# EasyEDA Pro project DEVELOPMENT-BOARD-PIC16F887.eprj

# Schematic Schematic1
Board Name: Board1; Create Date: 2025-02-07; Page Name: P1; Project Name: Placa micros; Schematic Name: Schematic1; Update Date: 2025-03-17; Company: EasyEDA.com; Page Size: A4; Version: V1.0
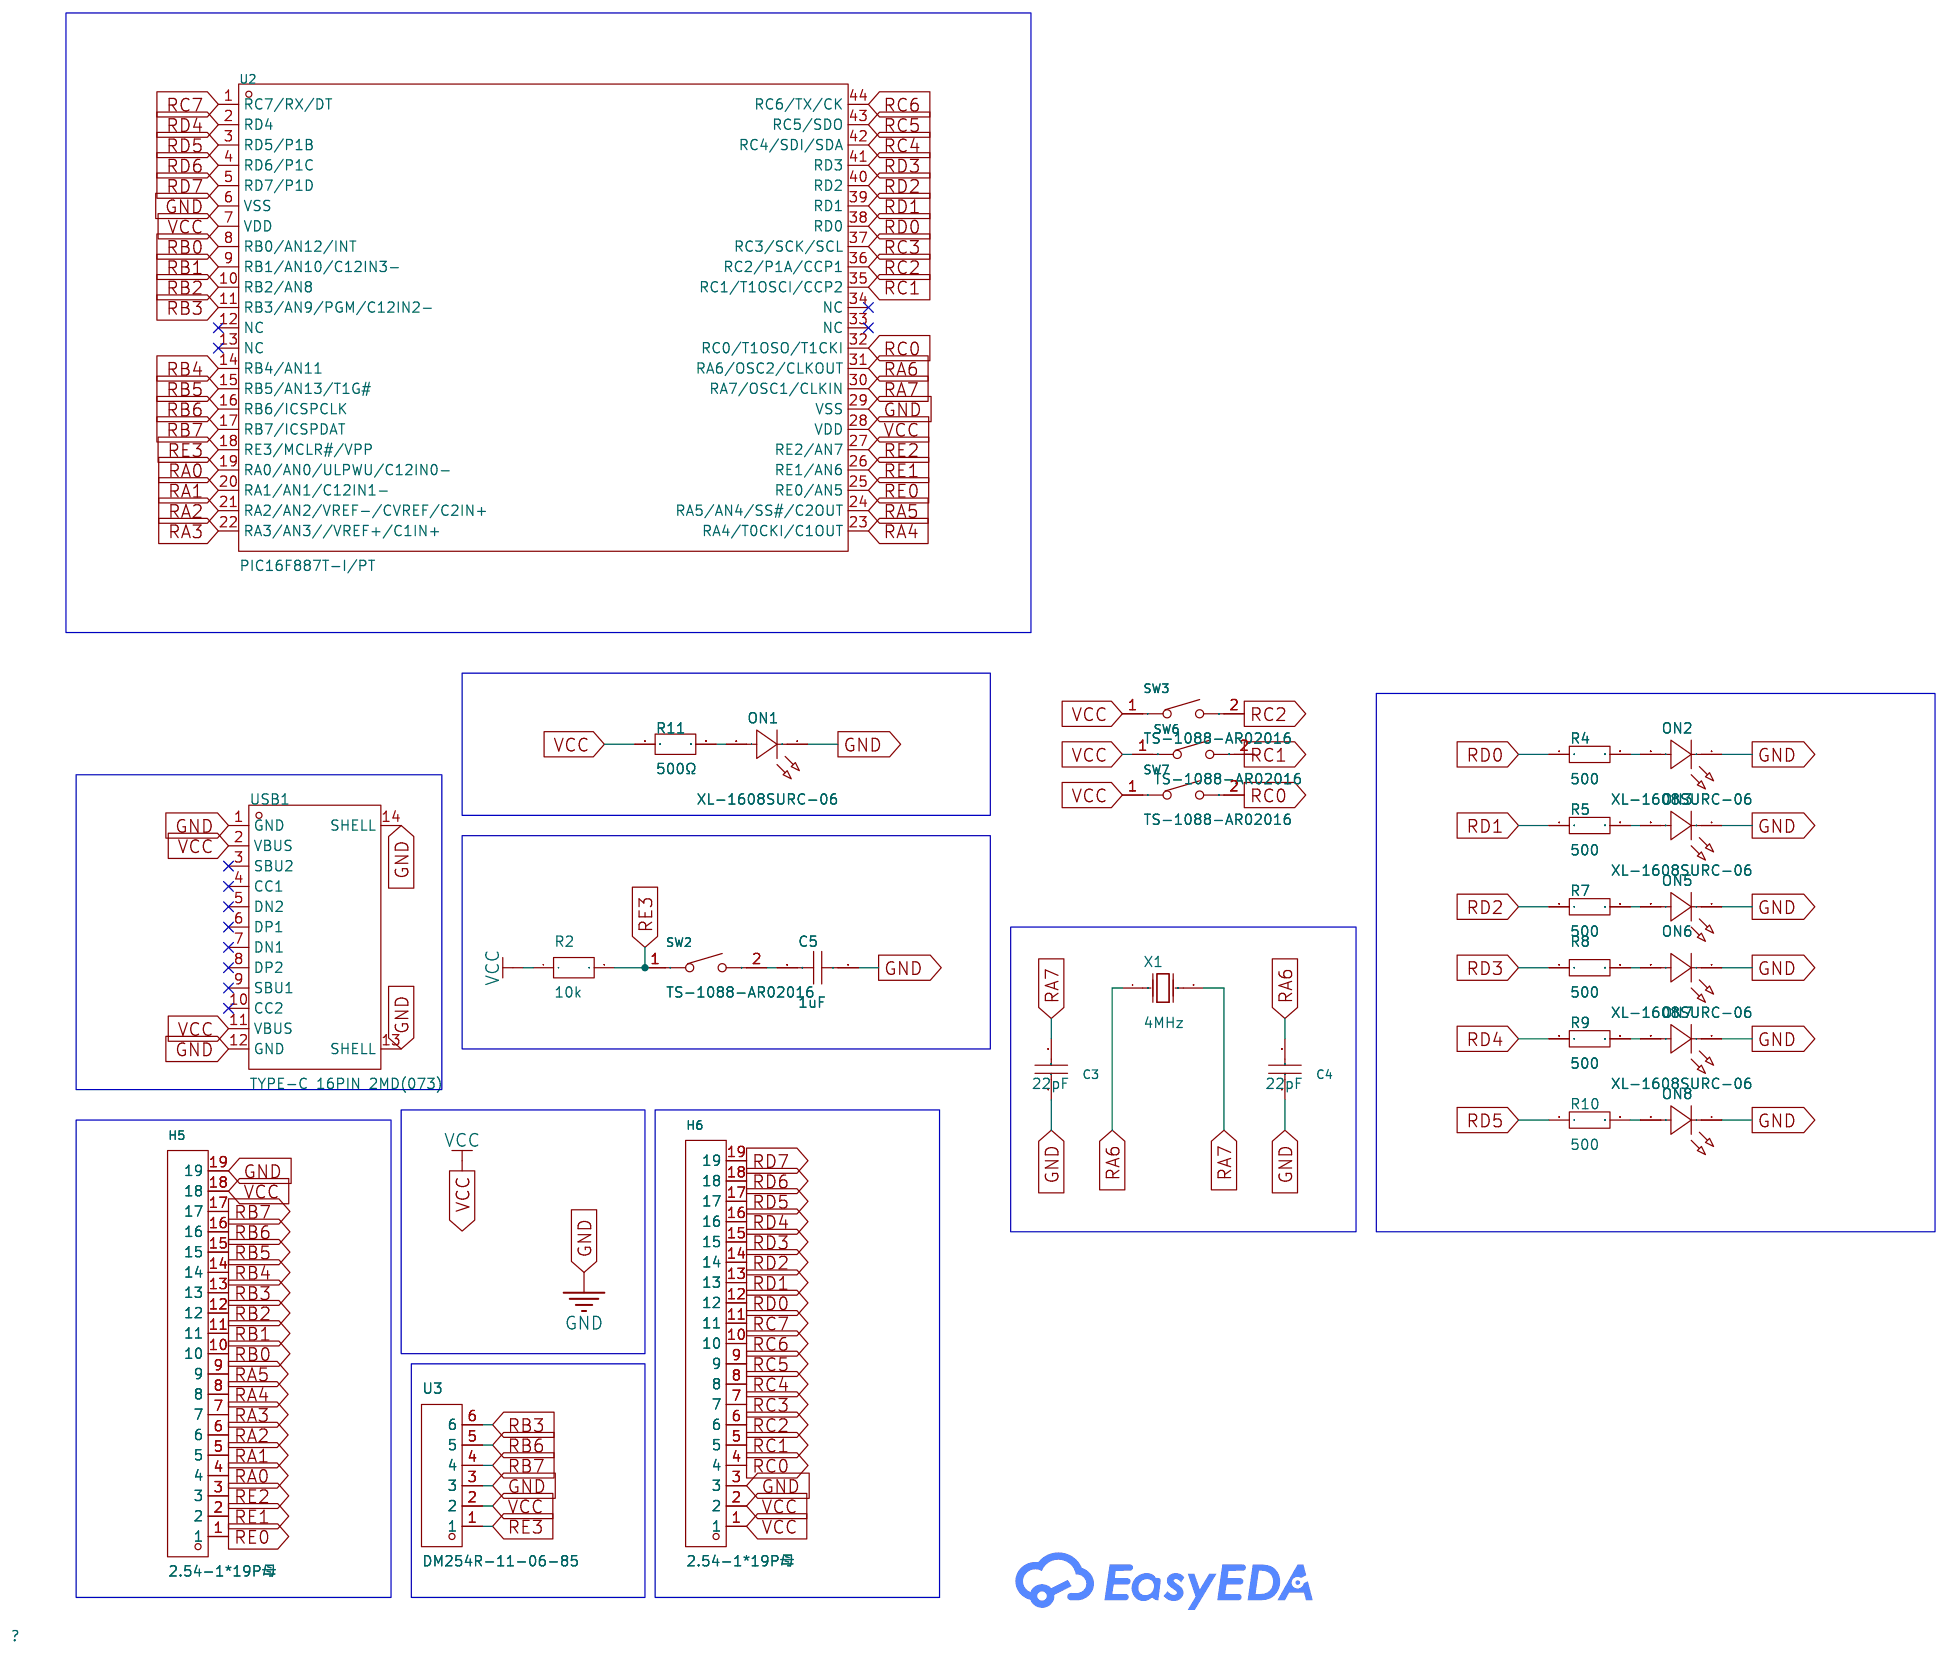
[diagram p0: schematic sheet]

## Parts
C3  22pF  [C0402]
C4  22pF  [C0402]
C5  1uF  [C0603]
H5  2.54-1*19P母  [HDR-TH_19P-P2.54-V-F]
H6  2.54-1*19P母  [HDR-TH_19P-P2.54-V-F]
ON1  XL-1608SURC-06  [LED0603-RD_RED]
ON2  XL-1608SURC-06  [LED0603-RD_RED]
ON3  XL-1608SURC-06  [LED0603-RD_RED]
ON5  XL-1608SURC-06  [LED0603-RD_RED]
ON6  XL-1608SURC-06  [LED0603-RD_RED]
ON7  XL-1608SURC-06  [LED0603-RD_RED]
ON8  XL-1608SURC-06  [LED0603-RD_RED]
R2  10k  [R0805]
R4  500  [R0603]
R5  500  [R0603]
R7  500  [R0603]
R8  500  [R0603]
R9  500  [R0603]
R10  500  [R0603]
R11  500Ω  [R0805]
SW2  TS-1088-AR02016  [SW-SMD_L3.9-W3.0-P4.45]
SW3  TS-1088-AR02016  [SW-SMD_L3.9-W3.0-P4.45]
SW6  TS-1088-AR02016  [SW-SMD_L3.9-W3.0-P4.45]
SW7  TS-1088-AR02016  [SW-SMD_L3.9-W3.0-P4.45]
U2  PIC16F887T-I/PT  [TQFP-44_L10.0-W10.0-P0.80-LS12.0-BL]
U3  DM254R-11-06-85  [HDR-TH_6P-P2.54-V-F]
USB1  TYPE-C 16PIN 2MD(073)  [USB-C-SMD_TYPE-C-6PIN-2MD-073]
X1  4MHz  [HC-49S_L11.4-W4.5-LS12.5]

## Library data of the parts
C3 C4 = CC0402JRNPO9BN150: Capacitance: Tolerance:±5% Tolerance:±5% Voltage Rated: Temperature Coefficient:; LCSC Part Name: 15pF ±5% 50V; Supplier Part: C106997; Manufacturer: YAGEO(国巨); Supplier Footprint: 0402; JLCPCB Part Class: Extended Part; Datasheet: https://atta.szlcsc.com/upload/public/pdf/source/20170914/C128857_1505359892143968080.pdf; Supplier: LCSC; Tolerance: ±5%; Standardization Check: true
C5 = CL10A105KB8NNNC: Capacitance: Tolerance:±10% Tolerance:±10% Voltage Rated: Temperature Coefficient:; LCSC Part Name: 1uF ±10% 50V; Supplier Part: C15849; Manufacturer: SAMSUNG(三星); Supplier Footprint: 0603; JLCPCB Part Class: Basic Part; Datasheet: https://atta.szlcsc.com/upload/public/pdf/source/20160218/1457707763339.pdf; Supplier: LCSC; Tolerance: ±10%
H5 H6 = 2.54-1*19P母: Pitch:2.54mm Row Spacing:- Mounting Type:Straight Number of Rows:Plugin Number of Holes:19P Insulation Height:- Contact Material:- Contact Plating:-; LCSC Part Name: 间距:2.54mm 直插; Supplier Part: C319202; Manufacturer: BOOMELE(博穆精密); Supplier Footprint: 插件,P=2.54mm; JLCPCB Part Class: Extended Part; Supplier: LCSC; Pitch: 2.54mm; Mounting Type: Straight; Number of Rows: Plugin; Number of Holes: 19P
ON1-ON3 ON5-ON8 = XL-1608SURC-06: Lamp Holder Type:- Illumination Color:Red Voltage - Forward(Vf):2.3V Voltage - Forward(Vf):2.3V Power(Watts):50mW Forward Current:20mA Wavelength - Dominant:620nm~630nm Wavelength - Dominant:620nm~630nm Peak Wavelength:625nm Diode Configuration:- Lens Col; Supplier Part: C965799; Manufacturer: XINGLIGHT(成兴光); Supplier Footprint: 0603; JLCPCB Part Class: Extended Part; Datasheet: https://atta.szlcsc.com/upload/public/pdf/source/20250212/74D884F187BF9607261CE4CBEB661ED7.pdf; Supplier: LCSC; Illumination Color: Red; Voltage - Forward(Vf): 2.3V; Power(Watts): 50mW; Forward Current: 20mA; Wavelength - Dominant: 620nm~630nm; Peak Wavelength: 625nm; Lens Color: Colorless Transparent Lens; Luminous Intensity: 225mcd; Viewing Angle: 120°; Mounting Sytle: Positive Stick; Operating Temperature: -20℃~+85℃; Standardization Check: true
R2 = ARG05BTC5001N: Type:Thin Film Resistor Resistance: Tolerance:±0.1% Tolerance:±0.1% Power(Watts): Overload Voltage (Max): Temperature Coefficient:±25ppm/℃ Temperature Coefficient:±25ppm/℃ Operating Temperature Range:-55℃~+155℃ Operating Temperature Range:-55℃~+155℃; LCSC Part Name: 薄膜电阻 5kΩ ±0.1% 125mW; Supplier Part: C2828700; Manufacturer: Viking(光颉); Supplier Footprint: 0805; JLCPCB Part Class: Extended Part; Datasheet: https://atta.szlcsc.com/upload/public/pdf/source/20190816/C412422_E173BA386C6DD8245B6A88358EF9877A.pdf; Supplier: LCSC; Type: Thin Film Resistor; Tolerance: ±0.1%; Temperature Coefficient: ±25ppm/℃; Operating Temperature Range: -55℃~+155℃; Standardization Check: true
R4 R5 R7-R10 = 0603WAF3300T5E: Type:Thick Film Resistors Resistance: Tolerance:±1% Tolerance:±1% Power(Watts): Overload Voltage (Max): Temperature Coefficient:±100ppm/℃ Temperature Coefficient:±100ppm/℃ Operating Temperature Range:-55℃~+155℃ Operating Temperature Range:-55℃~+155℃; LCSC Part Name: 330Ω ±1% 100mW 厚膜电阻; Supplier Part: C23138; Manufacturer: UNI-ROYAL(厚声); Supplier Footprint: 0603; JLCPCB Part Class: Basic Part; Datasheet: https://atta.szlcsc.com/upload/public/pdf/source/20200306/C422600_1E6D84923E4A46A82E41ADD87F860B5C.pdf; Supplier: LCSC; Type: Thick Film Resistors; Tolerance: ±1%; Temperature Coefficient: ±100ppm/℃; Operating Temperature Range: -55℃~+155℃
R11 = ARG05FTC5000: Type:Thin Film Resistor Resistance: Tolerance:±1% Tolerance:±1% Power(Watts): Overload Voltage (Max): Temperature Coefficient:±25ppm/℃ Temperature Coefficient:±25ppm/℃ Operating Temperature Range:-55℃~+155℃ Operating Temperature Range:-55℃~+155℃; LCSC Part Name: 薄膜电阻 500Ω ±1% 125mW; Supplier Part: C2828857; Manufacturer: Viking(光颉); Supplier Footprint: 0805; JLCPCB Part Class: Extended Part; Datasheet: https://atta.szlcsc.com/upload/public/pdf/source/20210426/C2828737_35D2DDB0BDDA00747C2712435E28BBD4.pdf; Supplier: LCSC; Type: Thin Film Resistor; Tolerance: ±1%; Temperature Coefficient: ±25ppm/℃; Operating Temperature Range: -55℃~+155℃
SW2 SW3 SW6 SW7 = TS-1088-AR02016: Circuit:SPST Actuator Style:Round Button Operating Force:160gf Mounting Style:Brick nogging Switch Length:4mm Switch Width:3mm Switch Height:2mm Strike Gundam:不带 Contact Current:50mA Voltage Rating (DC):12V Insulation Resistance:100MΩ Actuator/Cap Color:B; LCSC Part Name: 4*3*2mm 立贴 轻触开关; Supplier Part: C720477; Manufacturer: XUNPU(讯普); Supplier Footprint: SMD; JLCPCB Part Class: Extended Part; Datasheet: https://atta.szlcsc.com/upload/public/pdf/source/20200810/C720475_60D09DD6C54279ADDB2DC25100F1CC11.pdf; Supplier: LCSC; Circuit: SPST; Actuator Style: Round Button; Operating Force: 160gf; Mounting Style: Brick nogging; Switch Length: 4mm; Switch Width: 3mm; Switch Height: 2mm; Strike Gundam: 不带; Contact Current: 50mA; Voltage Rating (DC): 12V; Insulation Resistance: 100MΩ; Actuator/Cap Color: Black; Pin Style: SMDSplicing; Mechanical Life: 10万次; Operating Temperature: -30℃~+80℃; Standardization Check: true
U2 = PIC16F887T-I/PT: CPU Core:PIC Program Storage Size:14KB RAM Size:368Byte GPIO Ports Number:35 Operating Voltage Range:2V~5.5V Operating Voltage Range:2V~5.5V CPU Maximum Speed:20MHz Program Memory Type:FLASH EEPROM:256Byte Operating Temperature Range:-40℃~+85℃ Operating T; Supplier Part: C2651962; Manufacturer: MICROCHIP(美国微芯); Supplier Footprint: TQFP-44(10x10); JLCPCB Part Class: Extended Part; Datasheet: https://atta.szlcsc.com/upload/public/pdf/source/20180719/C220671_CD532A65A2F6F6B445C7E976F94E0D97.pdf; Supplier: LCSC; CPU Core: PIC; Program Storage Size: 14KB; RAM Size: 368Byte; GPIO Ports Number: 35; Operating Voltage Range: 2V~5.5V; CPU Maximum Speed: 20MHz; Program Memory Type: FLASH; EEPROM: 256Byte; Operating Temperature Range: -40℃~+85℃; ADC (Bit): 10bit; Peripheral/Function: WDT; Watchdog: 有; Low-Voltage Detect: 有; Internal Oscillator: 有
U3 = DM254R-11-06-85: Holes Structure:1x6P Pitch:2.54mm Row Spacing:- Circular Hole / Square Hole:Square Holes Mounting Type:Straight Number of Rows:Plugin Number of Holes:6P Current Rating (Max):3A Voltage Rating (Max):- Holes Direction:Top Insulation Height:8.5mm Operating T; LCSC Part Name: 间距:2.54mm 1x6P 直插; Supplier Part: C2935977; Manufacturer: DEALON(德艺隆); Supplier Footprint: 插件,P=2.54mm; JLCPCB Part Class: Extended Part; Datasheet: https://atta.szlcsc.com/upload/public/pdf/source/20220110/4E97995FE1BF9788ECBB6F72A9540C3B.pdf; Supplier: LCSC; Holes Structure: 1x6P; Pitch: 2.54mm; Circular Hole / Square Hole: Square Holes; Mounting Type: Straight; Number of Rows: Plugin; Number of Holes: 6P; Current Rating (Max): 3A; Holes Direction: Top; Insulation Height: 8.5mm
USB1 = TYPE-C 16PIN 2MD(073): Connector Type:Type-C Standard:USB 3.1 Gender:Female Mounting Style:Horizontal attachment Number of Contacts:16P Number of Ports:1 Current Rating - Power (Max):5A Operating Temperature Range:-25℃~+85℃ Operating Temperature Range:-25℃~+85℃ Rated Voltage (M; LCSC Part Name: Type-C 母 卧贴; Supplier Part: C2765186; Manufacturer: SHOU HAN(首韩); Supplier Footprint: SMD; JLCPCB Part Class: Extended Part; Datasheet: https://atta.szlcsc.com/upload/public/pdf/source/20211123/39B17C16241EAC15C5E277BDA434118E.pdf; Supplier: LCSC; Connector Type: Type-C; Standard: USB 3.1; Gender: Female; Mounting Style: Horizontal attachment; Number of Contacts: 16P; Number of Ports: 1; Current Rating - Power (Max): 5A; Operating Temperature Range: -25℃~+85℃; Rated Voltage (Max): 5V; Connect-Disconnect Life: 5000 Cuts; Core Colour: Black; Standardization Check: true
X1 = X49SM4MSD2SC: Crystal Type:Surface Mount Crystal Frequency: Normal temperature Frequency Tolerance:±20ppm Normal temperature Frequency Tolerance:±20ppm External load capacitor: Frequency Stability(Full temperature range):±30ppm Frequency Stability(Full temperature rang; LCSC Part Name: 4MHz ±20ppm 20pF; Supplier Part: C13774; Manufacturer: YXC(扬兴晶振); Supplier Footprint: HC-49S-SMD; JLCPCB Part Class: Extended Part; Datasheet: https://atta.szlcsc.com/upload/public/pdf/source/20240329/3EBF42EBCAB50CA65B6FA9D7CFA1955A.pdf; Supplier: LCSC; Crystal Type: Surface Mount Crystal; Normal temperature Frequency Tolerance: ±20ppm; Frequency Stability(Full temperature range): ±30ppm

## Nets
GND: C3.1 C4.1 C5.1 H5.19 H6.3 ON1.1(K) ON2.1(K) ON3.1(K) ON5.1(K) ON6.1(K) ON7.1(K) ON8.1(K) U2.6(VSS) U2.29(VSS) U3.3 USB1.1(GND) USB1.12(GND) USB1.13(SHELL) USB1.14(SHELL)
VCC: H5.18 H6.1 H6.2 R2.1 R11.1 SW3.1 SW6.1 SW7.1 U2.7(VDD) U2.28(VDD) U3.2 USB1.2(VBUS) USB1.11(VBUS)
RA0: H5.4 U2.19(RA0/AN0/ULPWU/C12IN0-)
RA1: H5.5 U2.20(RA1/AN1/C12IN1-)
RA2: H5.6 U2.21(RA2/AN2/VREF-/CVREF/C2IN+)
RA3: H5.7 U2.22(RA3/AN3//VREF+/C1IN+)
RA4: H5.8 U2.23(RA4/T0CKI/C1OUT)
RA5: H5.9 U2.24(RA5/AN4/SS#/C2OUT)
RA6: C4.2 U2.31(RA6/OSC2/CLKOUT) X1.1(OSC1)
RA7: C3.2 U2.30(RA7/OSC1/CLKIN) X1.2(OSC2)
RB0: H5.10 U2.8(RB0/AN12/INT)
RB1: H5.11 U2.9(RB1/AN10/C12IN3-)
RB2: H5.12 U2.10(RB2/AN8)
RB3: H5.13 U2.11(RB3/AN9/PGM/C12IN2-) U3.6
RB4: H5.14 U2.14(RB4/AN11)
RB5: H5.15 U2.15(RB5/AN13/T1G#)
RB6: H5.16 U2.16(RB6/ICSPCLK) U3.5
RB7: H5.17 U2.17(RB7/ICSPDAT) U3.4
RC0: H6.4 SW7.2 U2.32(RC0/T1OSO/T1CKI)
RC1: H6.5 SW6.2 U2.35(RC1/T1OSCI/CCP2)
RC2: H6.6 SW3.2 U2.36(RC2/P1A/CCP1)
RC3: H6.7 U2.37(RC3/SCK/SCL)
RC4: H6.8 U2.42(RC4/SDI/SDA)
RC5: H6.9 U2.43(RC5/SDO)
RC6: H6.10 U2.44(RC6/TX/CK)
RC7: H6.11 U2.1(RC7/RX/DT)
RD0: H6.12 R4.1 U2.38(RD0)
RD1: H6.13 R5.1 U2.39(RD1)
RD2: H6.14 R7.1 U2.40(RD2)
RD3: H6.15 R8.1 U2.41(RD3)
RD4: H6.16 R9.1 U2.2(RD4)
RD5: H6.17 R10.1 U2.3(RD5/P1B)
RD6: H6.18 U2.4(RD6/P1C)
RD7: H6.19 U2.5(RD7/P1D)
RE0: H5.1 U2.25(RE0/AN5)
RE1: H5.2 U2.26(RE1/AN6)
RE2: H5.3 U2.27(RE2/AN7)
RE3: R2.2 SW2.1 U2.18(RE3/MCLR#/VPP) U3.1
$1N21568: ON1.2(A) R11.2
$1N29055: ON2.2(A) R4.2
$1N29163: ON3.2(A) R5.2
$1N29377: ON5.2(A) R7.2
$1N29490: C5.2 SW2.2
$1N32112: ON6.2(A) R8.2
$1N32114: ON8.2(A) R10.2
$1N32116: ON7.2(A) R9.2

Not connected (* = marked no-connect by the designer): U2 12(NC)* 13(NC)* 33(NC)* 34(NC)*; USB1 3(SBU2)* 4(CC1)* 5(DN2)* 6(DP1)* 7(DN1)* 8(DP2)* 9(SBU1)* 10(CC2)*

# Board PCB2
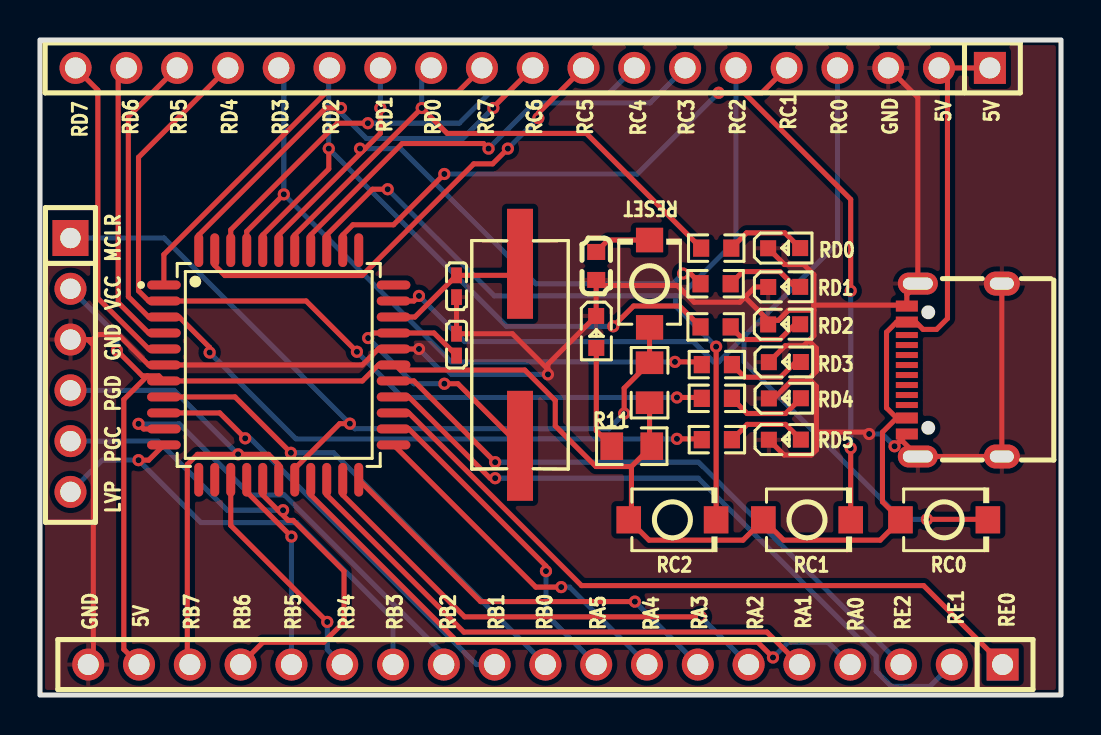
[diagram p1: board, top side]
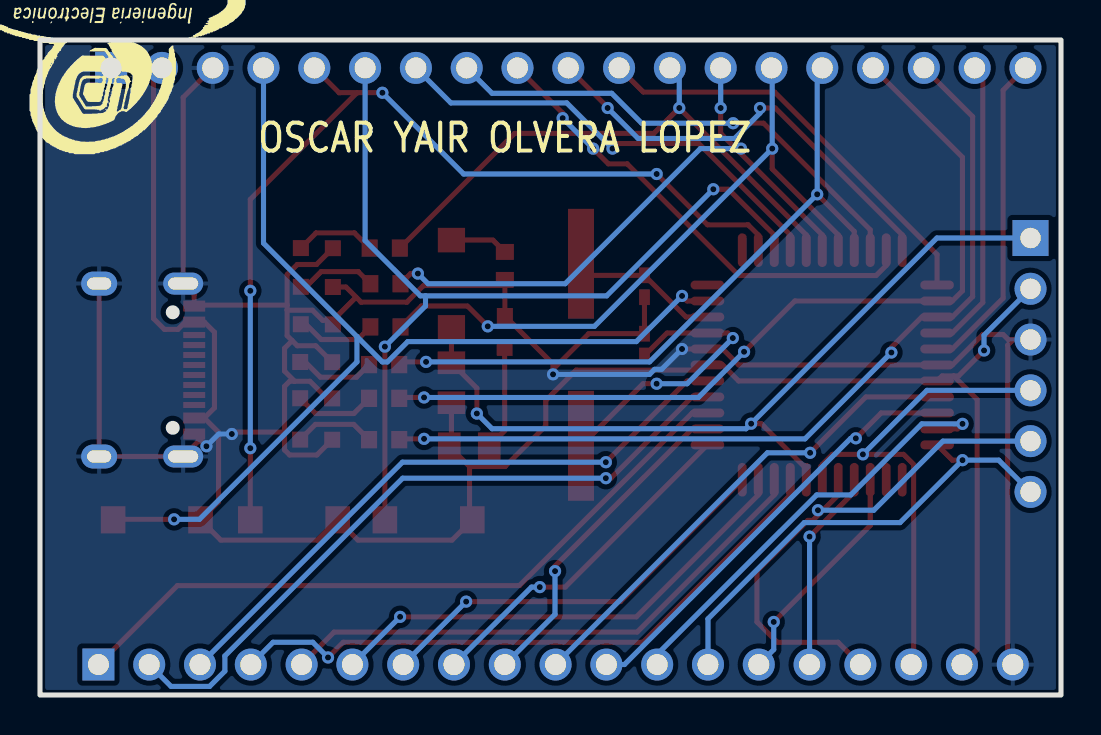
[diagram p2: board, bottom side, seen from below]

Outline 51.05 x 32.77 mm; copper layers: Top Layer, Bottom Layer. Coordinates in mm from the lower left corner of the outline.
Outline path: rectangle 0,32.77 51.05,0
Stack: Top Layer 0.035mm / Dielectric1 1.51mm FR4 er 4.5 / Bottom Layer 0.035mm

## Design rules (mm)
template: Custom Config
spacing copperThickness1oz (default): track to track 0.102, other pairs 0.152 to 0.3
spacing copperThickness2oz: track to track 0.203, other pairs 0.152 to 0.3
spacing safeClearance1: track to track 0.152, other pairs 0.152 to 0.152
track width copperThickness1oz (default): min 0.127, default 0.254, max 2.54
track width copperThickness2oz: min 0.203, default 0.254, max 2.54
differential pair differentialPair (default): width min 0.127, default 0.254, max 2.54; gap min 0.152, default 0.152
via viaSize (default): diameter min 0.5, default 0.61, max 10; hole min 0.3, default 0.305, max 6.3

## Placement (name value [footprint] x y rotation side)
C3  22pF  [C0402]  20.83 17.53 270 top
C4  22pF  [C0402]  20.83 20.45 90 top
C5  1uF  [C0603]  27.81 21.46 90 top
H5  2.54-1*19P母  [HDR-TH_19P-P2.54-V-F]  25.27 1.52 180 top
H6  2.54-1*19P母  [HDR-TH_19P-P2.54-V-F]  24.64 31.37 180 top
ON1  XL-1608SURC-06  [LED0603-RD_RED]  27.81 18.16 270 top
ON2  XL-1608SURC-06  [LED0603-RD_RED]  37.21 22.35 0 top
ON3  XL-1608SURC-06  [LED0603-RD_RED]  37.21 20.41 0 top
ON5  XL-1608SURC-06  [LED0603-RD_RED]  37.21 18.54 0 top
ON6  XL-1608SURC-06  [LED0603-RD_RED]  37.24 16.66 0 top
ON7  XL-1608SURC-06  [LED0603-RD_RED]  37.24 14.84 0 top
ON8  XL-1608SURC-06  [LED0603-RD_RED]  37.24 12.77 0 top
R2  10k  [R0805]  30.48 15.62 90 top
R4  500  [R0603]  33.81 22.36 0 top
R5  500  [R0603]  33.78 20.57 0 top
R7  500  [R0603]  33.78 18.42 0 top
R8  500  [R0603]  33.85 16.53 0 top
R9  500  [R0603]  33.85 14.84 0 top
R10  500  [R0603]  33.85 12.77 0 top
R11  500Ω  [R0805]  29.59 12.45 180 top
SW2  TS-1088-AR02016  [SW-SMD_L3.9-W3.0-P4.45]  30.48 20.57 90 top
SW3  TS-1088-AR02016  [SW-SMD_L3.9-W3.0-P4.45]  31.62 8.76 0 top
SW6  TS-1088-AR02016  [SW-SMD_L3.9-W3.0-P4.45]  38.35 8.76 0 top
SW7  TS-1088-AR02016  [SW-SMD_L3.9-W3.0-P4.45]  45.21 8.76 0 top
U2  PIC16F887T-I/PT  [TQFP-44_L10.0-W10.0-P0.80-LS12.0-BL]  11.94 16.51 270 top
U3  DM254R-11-06-85  [HDR-TH_6P-P2.54-V-F]  1.52 16.51 270 top
USB1  TYPE-C 16PIN 2MD(073)  [USB-C-SMD_TYPE-C-6PIN-2MD-073]  45.72 16.26 90 top
X1  4MHz  [HC-49S_L11.4-W4.5-LS12.5]  24 17.02 90 top

## Footprints (pads in the part's own frame, mm; a bottom-side part is the same pattern mirrored in y, then rotated)
C0402
  rect 0.79x0.54 smd: 1(-0.545,0) 2(0.545,0)
C0603
  rect 0.8x0.9 smd: 1(-0.7,0) 2(0.7,0)
HC-49S_L11.4-W4.5-LS12.5
  rect 5.5x1.3 smd: 1(4.553,0) 2(-4.553,0)
HDR-TH_6P-P2.54-V-F
  rect 1.8x1.8 hole 1.02: 1(-6.35,0)
  round 1.6 hole 1.02: 2(-3.81,0) 3(-1.27,0) 4(1.27,0) 5(3.81,0) 6(6.35,0)
HDR-TH_19P-P2.54-V-F
  rect 1.6x1.6 hole 1.05: 1(-22.86,0)
  round 1.6 hole 1.05: 2(-20.32,0) 3(-17.78,0) 4(-15.24,0) 5(-12.7,0) 6(-10.16,0) 7(-7.62,0) 8(-5.08,0) 9(-2.54,0) 10(0,0) 11(2.54,0) 12(5.08,0) 13(7.62,0) 14(10.16,0) 15(12.7,0) 16(15.24,0) 17(17.78,0) 18(20.32,0) 19(22.86,0)
LED0603-RD_RED
  rect 0.8x0.8 smd: 1(-0.799,-0.004) 2(0.799,0.004)
R0603
  rect 0.806x0.864 smd: 1(-0.753,0) 2(0.753,0)
R0805
  rect 1.133x1.377 smd: 1(-1,0) 2(1,0)
SW-SMD_L3.9-W3.0-P4.45
  rect 1.23x1.36 smd: 1(-2.185,0) 2(2.185,0)
TQFP-44_L10.0-W10.0-P0.80-LS12.0-BL
  oval 0.448x1.684 smd: 1(-4,-5.742) 2(-3.2,-5.742) 3(-2.4,-5.742) 4(-1.6,-5.742) 5(-0.8,-5.742) 6(0,-5.742) 7(0.8,-5.742) 8(1.6,-5.742) 9(2.4,-5.742) 10(3.2,-5.742) 11(4,-5.742) 23(4,5.742) 24(3.2,5.742) 25(2.4,5.742) 26(1.6,5.742) 27(0.8,5.742) 28(0,5.742) 29(-0.8,5.742) 30(-1.6,5.742) 31(-2.4,5.742) 32(-3.2,5.742) 33(-4,5.742)
  oval 1.684x0.448 smd: 12(5.742,-4) 13(5.742,-3.2) 14(5.742,-2.4) 15(5.742,-1.6) 16(5.742,-0.8) 17(5.742,0) 18(5.742,0.8) 19(5.742,1.6) 20(5.742,2.4) 21(5.742,3.2) 22(5.742,4) 34(-5.742,4) 35(-5.742,3.2) 36(-5.742,2.4) 37(-5.742,1.6) 38(-5.742,0.8) 39(-5.742,0) 40(-5.742,-0.8) 41(-5.742,-1.6) 42(-5.742,-2.4) 43(-5.742,-3.2) 44(-5.742,-4)
USB-C-SMD_TYPE-C-6PIN-2MD-073
  rect 0.55x1.1 smd: 1(-3.2,2.375) 2(-2.4,2.375) 11(2.4,2.375) 12(3.2,2.375)
  rect 0.3x1.1 smd: 3(-1.75,2.375) 4(-1.25,2.375) 5(-0.75,2.375) 6(-0.25,2.375) 7(0.25,2.375) 8(0.75,2.375) 9(1.25,2.375) 10(1.75,2.375)
  oval 1.1x2 hole 0.6x1.5: 13(-4.325,1.825) 14(4.325,1.825)
  oval 1.2x1.8 hole 0.6x1.2: 13(-4.325,-2.375) 14(4.325,-2.375)

## Nets
As in the schematic.

Pads without a net: U2 12 13 33 34; USB1 3 4 5 6 7 8 9 10

## Via types
v1: diameter 0.61, hole 0.305, Top Layer to Bottom Layer, 50 vias

## Routing (per net, layer and track width the routed paths; a pad name or vN(x,y) marks a point on that pad's centre or on a via; arc(x,y) is an arc through that point)
GND: length 124.9
  Top Layer w0.254: 35.25,19.9 35,19.65 32.71,19.65 31.87,20.48 27.81,20.48 ; 35.25,19.9 36.41,18.74 ; 35.25,19.9 35.76,20.41 ON3.1 ; 36.41,18.74 36.92,18.74 37.43,19.25 38.7,19.25 ; 36.41,18.74 ON5.1 ; 25.4,16.29 v1(25.4,16.04) ; 25.4,16.29 23.62,18.07 C3.1 C4.1 ; 25.4,16.29 25.4,16.55 ON1.1 27.81,20.48 ; 38.83,13.15 38.83,15.44 38.57,15.69 38.32,15.69 ; 38.83,13.15 41.36,13.15 v1(41.46,13.06) ; 38.83,13.15 38.83,12.26 38.57,12.01 37.21,12.01 ON8.1 ; 42.99,12.7 USB1.1 ; 42.99,12.7 43.13,12.7 USB1.13 USB1.13 USB1.14 ; 42.99,12.7 v1(42.73,12.44) ; 2.39,17.78 2.64,17.78 2.89,18.03 3.91,18.03 5.43,16.51 U2.6 16.12,16.51 16.92,17.31 U2.29 v1(18.95,17.31) ; 2.39,17.78 U3.3 ; 2.39,17.78 2.67,17.5 2.67,1.78 2.41,1.52 ; 27.81,20.48 C5.1 ; 38.44,17.73 38.83,17.34 38.83,16.2 38.32,15.69 ; 38.44,17.73 38.19,17.47 37.27,17.47 ON6.1 ; 38.44,17.73 38.7,17.98 38.7,19.25 ; 38.32,15.69 37.55,15.69 36.79,14.93 36.54,14.93 36.45,14.84 ; 38.7,19.25 38.7,19.5 ; 38.7,19.5 43.3,19.5 USB1.12 43.34,20.03 USB1.14 43.89,29.89 H6.3 ; 38.7,19.5 38.7,21.03 38.19,21.54 37.23,21.54 ON2.1
  Bottom Layer w0.254: v1(42.73,12.44) 42.12,13.06 v1(41.46,13.06) ; v1(25.4,16.04) 20.57,16.04 20.32,16.29 19.97,16.29 v1(18.95,17.31)
VCC: length 100.1
  Top Layer w0.254: H6.1 H6.2 45.38,30.95 45.38,18.83 44.83,18.29 44.16,18.29 43.79,18.66 USB1.11 42.84,18.66 42.33,18.15 42.33,14.36 42.84,13.86 ; 42.84,13.86 USB1.2 ; 42.84,13.86 42.13,13.15 42.13,9.66 SW7.1 42.01,7.75 37.18,7.75 SW6.1 35.15,7.75 30.45,7.75 SW3.1 29.58,8.9 29.58,11.43 ; R2.1 30.48,12.56 R11.1 29.58,11.43 ; 29.58,11.43 27.8,11.43 25.77,13.46 25.77,14.73 24.24,16.26 18.03,16.26 17.78,16.51 U2.28 16.92,16.51 16.12,15.71 U2.7 5.94,15.96 5.37,15.96 ; H5.18 4.19,2.29 4.19,14.78 5.37,15.96 ; 5.37,15.96 5.12,15.96 v1(3.85,17.23)
  Bottom Layer w0.254: U3.2 3.85,18 v1(3.85,17.23)
RA0: length 31.9
  Top Layer w0.254: v1(36.65,1.88) 35.89,2.64 20.9,2.64 13.54,10.01 U2.19
  Bottom Layer w0.254: v1(36.65,1.88) 37.41,2.64 39.4,2.64 H5.4
RA1: length 27.9
  Top Layer w0.254: U2.20 14.34,10.01 21.2,3.15 36.35,3.15 37.97,1.52
RA2: length 24.6
  Top Layer w0.254: v1(33.05,3.91) 21.23,3.91 15.14,10.01 U2.21
  Bottom Layer w0.254: v1(33.05,3.91) 35.43,1.52
RA3: length 20.8
  Top Layer w0.254: U2.22 22.03,4.67 v1(29.74,4.67)
  Bottom Layer w0.254: v1(29.74,4.67) H5.7
RA4: length 17.2
  Top Layer w0.254: v1(26.06,5.4) 24.79,5.4 U2.23
  Bottom Layer w0.254: H5.8 26.48,5.4 v1(26.06,5.4)
RA5: length 16.4
  Top Layer w0.254: v1(25.3,6.2) 25.3,6.45 18.44,13.31 U2.24
  Bottom Layer w0.254: v1(25.3,6.2) 25.3,4.04 27.81,1.52
RA6: length 7.4
  Top Layer w0.254: U2.31 18.75,18.91 C4.2 23.42,20.99 X1.1
RA7: length 14.8
  Top Layer w0.254: v1(16.41,17.86) 16.66,18.11 U2.30 19.7,18.11 C3.2 ; v1(20.22,15.57) 20.9,15.57 X1.2
  Bottom Layer w0.254: v1(20.22,15.57) 18.7,15.57 v1(16.41,17.86)
RB0: length 24.6
  Top Layer w0.254: U2.8 9.75,14.91 v1(12.55,12.12)
  Bottom Layer w0.254: v1(12.55,12.12) 14.68,12.12 H5.10
RB1: length 21.8
  Top Layer w0.254: v1(10.26,12.84) 8.99,14.11 U2.9
  Bottom Layer w0.254: H5.11 21.83,1.52 10.51,12.84 v1(10.26,12.84)
RB2: length 21.9
  Top Layer w0.254: v1(4.93,13.56) 5.18,13.31 U2.10
  Bottom Layer w0.254: 20.19,1.52 20.09,1.63 20.09,2.13 12.22,10.01 10.51,10.01 6.96,13.56 v1(4.93,13.56)
RB3: length 23.9
  Top Layer w0.254: U2.11 5.43,11.75 v1(4.93,11.75)
  Bottom Layer w0.254: U3.6 3.11,11.75 v1(4.93,11.75) 8.05,8.62 12.84,8.62 17.65,3.81 17.65,1.52
RB4: length 11.6
  Top Layer w0.254: U2.14 9.54,8.48 v1(14.36,3.66)
  Bottom Layer w0.254: H5.14 14.36,2.27 v1(14.36,3.66)
RB5: length 10.2
  Top Layer w0.254: U2.15 10.34,10.16 v1(12.57,7.92)
  Bottom Layer w0.254: v1(12.57,7.92) H5.15
RB6: length 27.3
  Top Layer w0.254: 10.03,1.52 11.15,2.64 14.19,2.64 15.2,3.66 15.2,6.2 12.66,8.74 12.41,8.74 11.9,9.24 ; 11.9,9.24 11.14,10.01 U2.16 ; 11.9,9.24 v1(12.15,9.24)
  Bottom Layer w0.254: U3.5 5.9,12.7 9.36,9.24 v1(12.15,9.24)
RB7: length 25.5
  Top Layer w0.254: U2.17 11.94,11.53 11.43,12.04 v1(9.91,12.04) 7.87,12.04 7.37,11.53 7.37,1.65 7.49,1.52
  Bottom Layer w0.254: v1(9.91,12.04) 6.7,15.24 U3.4
RC0: length 51.6
  Top Layer w0.254: v1(18.95,19.96) 18.7,19.71 U2.32 ; v1(44.35,8.79) 47.37,8.79 SW7.2
  Bottom Layer w0.254: v1(18.95,19.96) 21.24,17.68 32.67,17.68 33.68,16.66 33.94,16.66 35.21,17.93 ; H6.4 39.88,22.6 35.21,17.93 ; 35.21,17.93 35.21,16.66 43.08,8.79 v1(44.35,8.79)
RC1: length 50
  Top Layer w0.254: 35.2,30.13 36.09,30.13 H6.5 ; 35.2,30.13 v1(33.93,30.13) ; 35.2,30.13 40.54,24.79 v1(40.54,20.22) ; v1(40.54,12.35) SW6.2 ; v1(20.22,26.06) 17.68,23.52 15.65,23.52 15.14,23.01 U2.35
  Bottom Layer w0.254: v1(33.93,30.13) 29.87,26.06 v1(20.22,26.06) ; v1(40.54,20.22) v1(40.54,12.35)
RC2: length 46.2
  Top Layer w0.254: v1(17.39,25.3) 16.62,25.3 14.34,23.01 U2.36 ; v1(33.81,17.43) 33.81,8.76
  Bottom Layer w0.254: 31.78,19.97 31.78,19.46 v1(33.81,17.43) ; 31.78,19.97 32.03,19.97 34.8,22.73 H6.6 ; 31.78,19.97 22.72,19.97 v1(17.39,25.3)
RC3: length 23.2
  Top Layer w0.254: U2.37 13.54,23.01 18.11,27.59 22.17,27.59 v1(22.43,27.33)
  Bottom Layer w0.254: v1(22.43,27.33) 24.71,29.62 30.51,29.62 H6.7
RC4: length 24.6
  Top Layer w0.254: v1(16.4,28.6) 14.87,28.6 9.54,23.27 U2.42
  Bottom Layer w0.254: H6.8 28.45,30.1 22.46,30.1 20.97,28.6 v1(16.4,28.6)
RC5: length 23.9
  Top Layer w0.254: H6.9 24.92,29.11 v1(24.92,28.86) ; v1(23.39,27.33) 22.63,26.57 21.69,26.57 16.1,20.98 9.25,20.98 8.74,21.49 U2.43
  Bottom Layer w0.254: v1(23.39,27.33) v1(24.92,28.86)
RC6: length 22.4
  Top Layer w0.254: v1(15.05,29.36) 14.29,29.36 7.94,23.01 U2.44 ; H6.10 22.67,29.4 v1(22.67,29.36)
  Bottom Layer w0.254: v1(15.05,29.36) 15.05,29.11 16.32,27.84 21.15,27.84 v1(22.67,29.36)
RC7: length 21.3
  Top Layer w0.254: H6.11 20.89,30.16 14.32,30.16 6.2,22.03 U2.1
RD0: length 28.8
  Top Layer w0.254: U2.38 12.74,23.01 v1(19.09,29.36) 20.36,28.09 27.32,28.09 33.06,22.36
  Bottom Layer w0.254: H6.12 19.09,30.9 v1(19.09,29.36)
RD1: length 31.7
  Top Layer w0.254: R5.1 32.52,21.08 v1(32.16,21.08) ; 16.26,27.33 11.94,23.01 U2.39 ; 16.26,27.33 v1(16,27.33) ; 16.26,27.33 17.02,28.09 v1(17.02,29.36)
  Bottom Layer w0.254: v1(16,27.33) 18.03,27.33 24.79,20.57 31.65,20.57 v1(32.16,21.08) ; v1(17.02,29.36) H6.13
RD2: length 33.6
  Top Layer w0.254: U2.40 11.14,23.01 14.44,26.32 v1(14.44,27.33) ; v1(28.66,18.44) 29.68,19.46 31.99,19.46 R7.1
  Bottom Layer w0.254: H6.14 14.44,31.33 v1(14.44,27.33) 23.33,18.44 v1(28.66,18.44)
RD3: length 34.4
  Top Layer w0.254: v1(12.19,25.05) 10.34,23.19 U2.41 ; R8.1 32.96,16.66 v1(31.75,16.66)
  Bottom Layer w0.254: H6.15 12.19,31.12 v1(12.19,25.05) 20.57,16.66 v1(31.75,16.66)
RD4: length 43.4
  Top Layer w0.254: v1(15.85,17.17) 13.31,19.71 U2.2 5.43,19.71 4.93,20.22 4.93,26.9 H6.16 ; R9.1 33.05,14.88 v1(31.85,14.88)
  Bottom Layer w0.254: v1(15.85,17.17) 18.13,14.88 v1(31.85,14.88)
RD5: length 44.2
  Top Layer w0.254: v1(31.85,12.81) 33.05,12.81 R10.1 ; H6.17 4.42,28.93 4.42,19.93 5.43,18.91 U2.3 6.96,18.91 8.48,17.39 v1(8.48,17.13)
  Bottom Layer w0.254: v1(31.85,12.81) 12.8,12.81 v1(8.48,17.13)
RD6: length 14.8
  Top Layer w0.254: H6.18 3.91,30.96 3.91,19.63 5.43,18.11 U2.4
RD7: length 16.3
  Top Layer w0.254: H6.19 2.89,30.25 2.89,19.85 5.43,17.31 U2.5
RE0: length 35.7
  Top Layer w0.254: U2.25 18.44,14.11 27.08,5.47 44.18,5.47 H5.1
RE1: length 34.8
  Top Layer w0.254: U2.26 18.44,14.91 22.51,10.85 v1(22.76,10.85)
  Bottom Layer w0.254: v1(22.76,10.85) 32.92,10.85 41.81,1.96 41.81,1.19 42.57,0.43 44.5,0.43 45.59,1.52
RE2: length 31.2
  Top Layer w0.254: v1(22.76,11.65) 18.7,15.71 U2.27
  Bottom Layer w0.254: H5.3 32.93,11.65 v1(22.76,11.65)
RE3: length 41
  Top Layer w0.254: SW2.1 R2.2 29.21,15.35 v1(29.21,14.08) ; v1(15.49,13.57) 14.99,13.57 12.74,11.33 U2.18
  Bottom Layer w0.254: v1(29.21,14.08) 28.45,13.32 15.75,13.32 v1(15.49,13.57) 6.21,22.86 U3.1
$1N21568: length 5.2
  Top Layer w0.254: R11.2 27.82,13.22 ON1.2
$1N29055: length 4.1
  Top Layer w0.254: R4.2 35.33,23.12 37.25,23.12 ON2.2
$1N29163: length 4
  Top Layer w0.254: ON3.2 37.76,20.42 37,21.18 35.14,21.18 R5.2
$1N29377: length 4.1
  Top Layer w0.254: R7.2 35.17,17.78 36.99,17.78 37.76,18.55 ON5.2
$1N29490: length 2.9
  Top Layer w0.254: SW2.2 28.41,22.76 C5.2
$1N32112: length 4
  Top Layer w0.254: ON6.2 37.79,16.66 37.03,15.9 35.23,15.9 R8.2
$1N32114: length 4.1
  Top Layer w0.254: ON8.2 37.28,13.54 35.36,13.54 R10.2
$1N32116: length 4.1
  Top Layer w0.254: R9.2 35.36,14.08 37.28,14.08 ON7.2

## Copper pours and planes (outline as drawn; the poured copper is in the pictures)
GND on Top Layer: -0.76,33.15 51.69,33.15 51.69,-0.63 -0.76,-0.63
GND on Bottom Layer: -0.89,33.4 52.7,33.4 52.7,-1.78 -0.89,-1.78

## Text on the board
Bottom Silkscreen Layer: OSCAR YAIR OLVERA LOPEZ
Top Silkscreen Layer: RE2 | RE1 | RE0 | RD7 | MCLR | VCC | GND | PGD | PGC | RD6 | RD5 | RD4 | RD3 | RD2 | RD1 | RD0 | RC7 | RC6 | RC5 | RC4 | RC3 | RC2 | RC1 | RC0 | LVP | 5V | RB7 | RB6 | RB5 | RB4 | RB3 | RB2 | RB1 | RB0 | RA5 | RA4 | RA3 | RA2 | RA1 | RA0 | RESET
